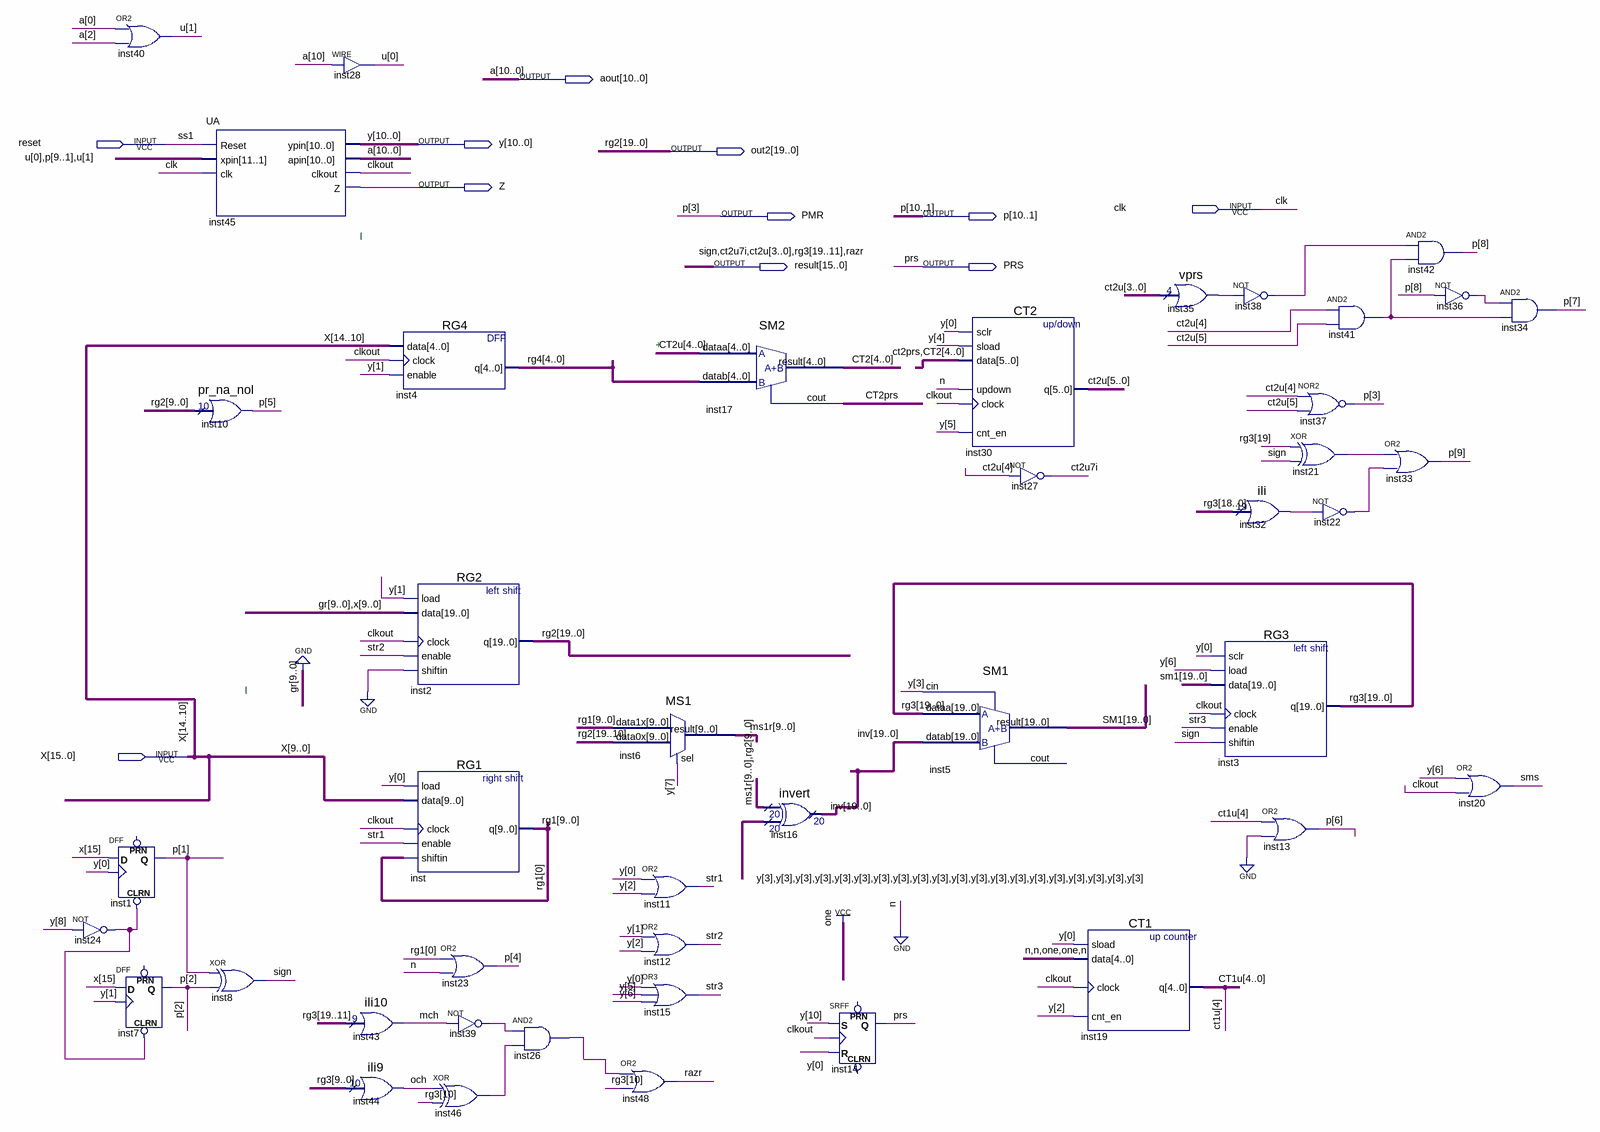
[diagram p0: schematic sheet]
// Quartus schematic kursovoi.bdf as structural Verilog: 43 symbols, 11 pins
module kursovoi (
  input  reset,
  input  clk,
  input  [15:0] X,
  output [10:0] aout,
  output [10:0] y,
  output [19:0] out2,
  output Z,
  output PMR,
  output [10:1] p,
  output [15:0] result,
  output PRS
);

  wire clkout, CT2prs, inst21_out, inst22_out, inst24_out, inst26_out, inst32_result, inst35_result,
       inst36_out, inst38_out, inst39_out, inst41_out, inst46_out, mch, och, sms, str1, str2, str3;
  wire [1:0] u;
  wire [4:0] ct1u, CT2, rg4;
  wire [5:4] ct2u;
  wire [9:0] ms1r, rg1;
  wire [10:0] rg3;
  wire [19:0] inv, SM1;

  not inst24 (inst24_out, y[8]);
  or inst40 (u[1], aout[0], aout[2]);
  DFF inst1 (.CLRN(inst24_out), .CLK(y[0]), .D(X[15]), .Q(p[1]));  // open: PRN
  DFF inst7 (.CLRN(inst24_out), .CLK(y[1]), .D(X[15]), .Q(p[2]));  // open: PRN
  UA inst45 (.Reset(reset), .xpin({u[0], p[9:1], u[1]}), .clk(clk), .ypin(y), .apin(aout), .clkout(clkout), .Z(Z));
  pr_na_nol inst10 (.data(out2[9:0]), .result(p[5]));
  xor inst8 (result[15], p[1], p[2]);
  assign u[0] = aout[10];  // WIRE inst28
  ili10 inst43 (.data(result[9:1]), .result(mch));
  ili9 inst44 (.data(rg3[9:0]), .result(och));
  RG4 inst4 (.data(X[14:10]), .clock(clkout), .enable(y[1]), .q(rg4));
  RG2 inst2 (.load(y[1]), .data({{10{1'b0}}, X[9:0]}), .clock(clkout), .enable(str2), .shiftin(1'b0), .q(out2));
  RG1 inst (.load(y[0]), .data(X[9:0]), .clock(clkout), .enable(str1), .shiftin(rg1[0]), .q(rg1));
  or inst23 (p[4], rg1[0], 1'b0);
  xor inst46 (inst46_out, och, rg3[10]);
  not inst39 (inst39_out, mch);
  and inst26 (inst26_out, inst39_out, inst46_out);
  MS1 inst6 (.data1x(rg1), .data0x(out2[19:10]), .sel(y[7]), .result(ms1r));
  or inst11 (str1, y[0], y[2]);
  or inst12 (str2, y[1], y[2]);
  or inst15 (str3, y[0], y[5], y[6]);
  or inst48 (result[0], inst26_out, rg3[10]);
  SM2 inst17 (.dataa({ct2u[4], result[13:10]}), .datab(rg4), .result(CT2), .cout(CT2prs));
  invert inst16 (.data0x({ms1r, out2[9:0]}), .data1x({20{y[3]}}), .result(inv));
  SRFF inst14 (.S(y[10]), .R(y[0]), .CLK(clkout), .Q(PRS));  // open: PRN, CLRN
  CT2 inst30 (
    .sclr(y[0]), .sload(y[4]), .data({CT2prs, CT2}), .updown(1'b0), .clock(clkout), .cnt_en(y[5]),
    .q({ct2u, result[13:10]}));
  SM1 inst5 (.dataa({result[9:1], rg3}), .datab(inv), .cin(y[3]), .result(SM1));  // open: cout
  not inst27 (result[14], ct2u[4]);
  CT1 inst19 (.sload(y[0]), .data(5'b00110), .clock(clkout), .cnt_en(y[2]), .q(ct1u));
  vprs inst35 (.data(result[13:10]), .result(inst35_result));
  not inst38 (inst38_out, inst35_result);
  ili inst32 (.data({result[8:1], rg3}), .result(inst32_result));
  RG3 inst3 (
    .sclr(y[0]), .load(y[6]), .data(SM1), .clock(clkout), .enable(str3), .shiftin(result[15]),
    .q({result[9:1], rg3}));
  nor inst37 (p[3], ct2u[4], ct2u[5]);
  xor inst21 (inst21_out, result[9], result[15]);
  or inst13 (p[6], ct1u[4], 1'b0);
  and inst41 (inst41_out, ct2u[4], ct2u[5]);
  not inst22 (inst22_out, inst32_result);
  and inst42 (p[8], inst38_out, inst41_out);
  or inst33 (p[9], inst21_out, inst22_out);
  not inst36 (inst36_out, p[8]);
  or inst20 (sms, y[6], clkout);
  and inst34 (p[7], inst36_out, inst41_out);

  assign PMR = p[3];

  // Other names for the same wires on the sheet: a[10:0] = aout; ct2u[3:0] = result[13:10]; ct2u7i = result[14];
  //   razr = result[0]; rg2[19:0] = out2; rg3[19:11] = result[9:1]; sign = result[15]; ss1 = reset

  // Notes on the sheet:
  //   l
  //   +
  //   l
endmodule
